# Altium project GD32F450_Main_Board_Camera_REV1.0.PrjPcb
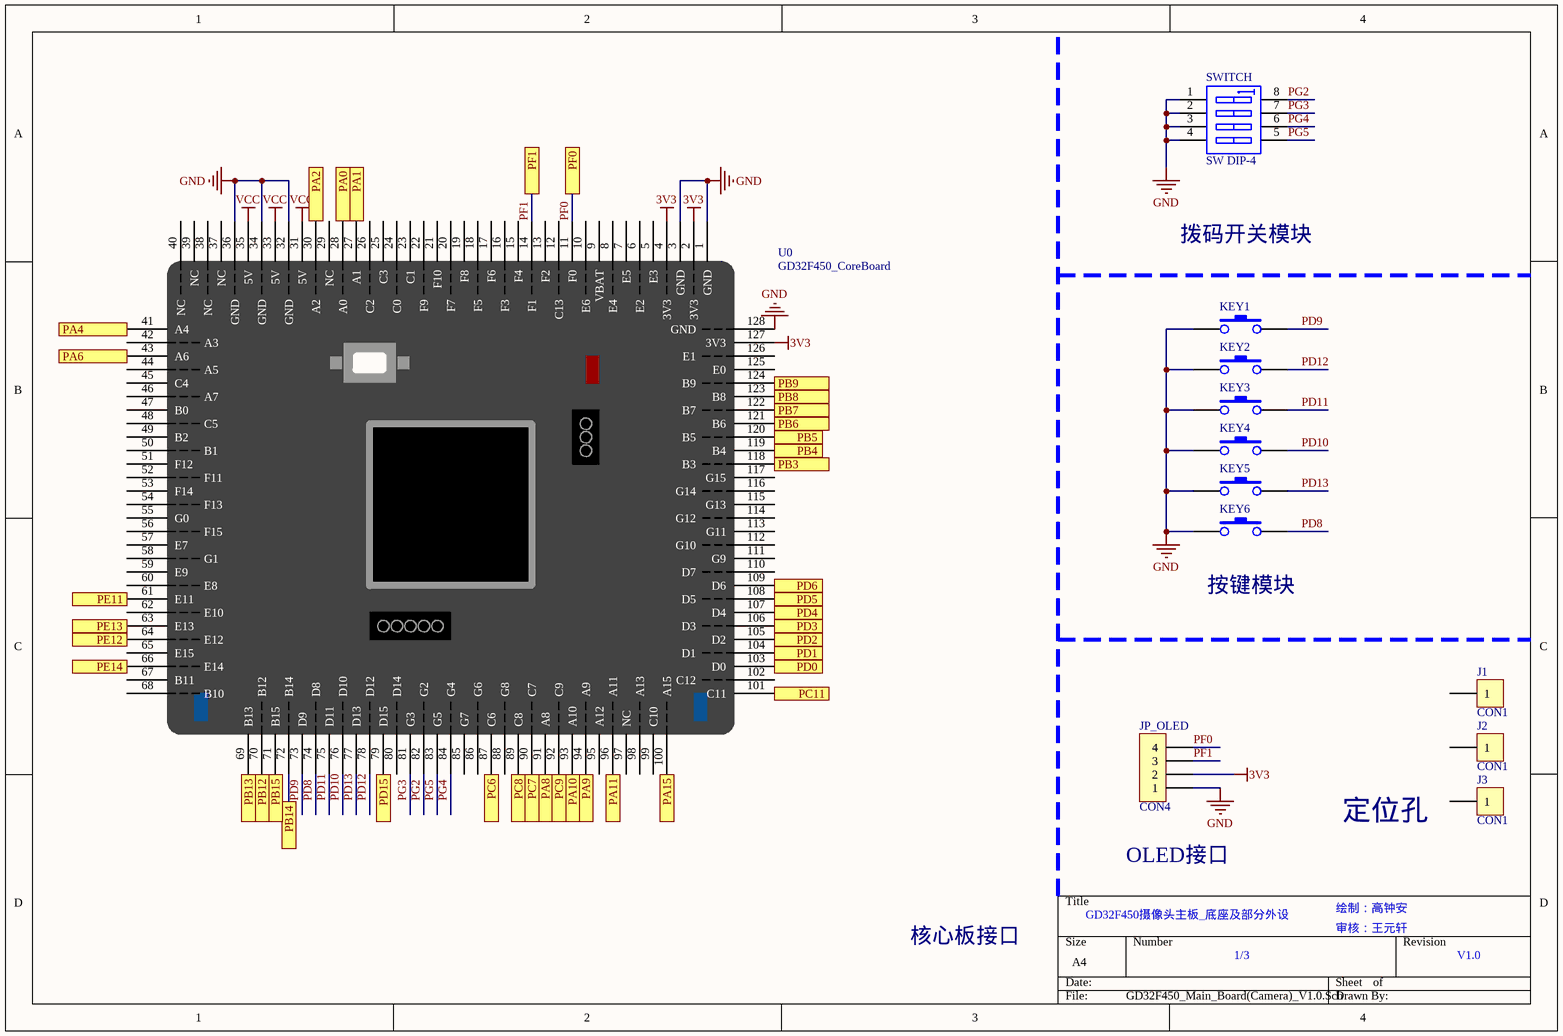
[diagram p0: GD32F450_Main_Board(Camera)_V1.0.SchDoc]
3 sheets, 73 parts. Net scope: flat (ports and power ports of the same name join across sheets).
Board files: Poly_GD32F450_Main_Board(Camera).PcbDoc, GD32F450_Main_Board(Camera).PcbDoc
Sheets:
  GD32F450_Main_Board(Camera)_V1.0.SchDoc
  GD32F450_Power_Manager(Camera)_V1.0.SchDoc
  GD32F450_External_Expansion(Camera)_V1.0.SchDoc

## Sheet GD32F450_Main_Board(Camera)_V1.0.SchDoc
size A4

### Parts
J1  CON1  [HOLE-3.5]
J2  CON1  [HOLE-3.5]
J3  CON1  [HOLE-3.5]
JP_OLED  CON4  [OLED]
KEY1  SW-PB  [KEY2-6X3]  (value not drawn)
KEY2  SW-PB  [KEY2-6X3]  (value not drawn)
KEY3  SW-PB  [KEY2-6X3]  (value not drawn)
KEY4  SW-PB  [KEY2-6X3]  (value not drawn)
KEY5  SW-PB  [KEY2-6X3]  (value not drawn)
KEY6  SW-PB  [KEY2-6X3]  (value not drawn)
SWITCH  SW DIP-4  [CSW DIP-4P]
U0  GD32F450_CoreBoard  [GD32F450_CoreBoard]

### Ports
PA0, PA1, PA2, PA4, PA6, PA8, PA9, PA10, PA11, PA15, PB3, PB4, PB5, PB6, PB7, PB8, PB9, PB12, PB13, PB14, PB15, PC6, PC7, PC8, PC9, PC11, PD0, PD1, PD2, PD3, PD4, PD5, PD6, PD15, PE11, PE12, PE13, PE14, PF0, PF1

### Nets
3V3: JP_OLED.2 U0.2(3V3) U0.4(3V3) U0.127(3V3)
GND: JP_OLED.1 KEY1.1 KEY2.1 KEY3.1 KEY4.1 KEY5.1 KEY6.1 SWITCH.1(A1) SWITCH.2(A2) SWITCH.3(A3) SWITCH.4(A4) U0.1(GND) U0.3(GND) U0.32(GND) U0.34(GND) U0.36(GND) U0.128(GND)
VCC: U0.31(5V) U0.33(5V) U0.35(5V)
PD8: KEY6.2 U0.74(D8)
PD9: KEY1.2 U0.73(D9)
PD10: KEY4.2 U0.76(D10)
PD11: KEY3.2 U0.75(D11)
PD12: KEY2.2 U0.78(D12)
PD13: KEY5.2 U0.77(D13)
PF0: JP_OLED.4 U0.11(F0) ; port PF0
PF1: JP_OLED.3 U0.14(F1) ; port PF1
PG2: SWITCH.8(B1) U0.82(G2)
PG3: SWITCH.7(B2) U0.81(G3)
PG4: SWITCH.6(B3) U0.84(G4)
PG5: SWITCH.5(B4) U0.83(G5)
NetJP_CameraZ_1: U0.87(C6) ; port PC6
NetJP_CameraZ_2: U0.43(A6) ; port PA6
NetJP_CameraZ_3: U0.90(C7) ; port PC7
NetJP_CameraZ_5: U0.89(C8) ; port PC8
NetJP_CameraZ_6: U0.118(B3) ; port PB3
NetJP_CameraZ_7: U0.92(C9) ; port PC9
NetJP_CameraZ_8: U0.100(A15) ; port PA15
NetJP_CameraZ_9: U0.101(C11) ; port PC11
NetJP_CameraZ_10: U0.41(A4) ; port PA4
NetJP_CameraZ_11: U0.121(B6) ; port PB6
NetJP_CameraZ_12: U0.122(B7) ; port PB7
NetJP_CameraZ_13: U0.123(B8) ; port PB8
NetJP_CameraZ_15: U0.124(B9) ; port PB9
NetJP_code1_3: U0.28(A0) ; port PA0
NetJP_code1_4: U0.27(A1) ; port PA1
NetJP_code2_3: U0.119(B4) ; port PB4
NetJP_code2_4: U0.120(B5) ; port PB5
NetJP_Moter_Drive_1: U0.91(A8) ; port PA8
NetJP_Moter_Drive_2: U0.94(A9) ; port PA9
NetJP_Moter_Drive_3: U0.93(A10) ; port PA10
NetJP_Moter_Drive_4: U0.96(A11) ; port PA11
NetJP_serial_port_5: U0.107(D4) ; port PD4
NetJP_serial_port_6: U0.109(D6) ; port PD6
NetJP_serial_port_8: U0.108(D5) ; port PD5
NetJP_Stear_1: U0.30(A2) ; port PA2
NetJP_TFT_3: U0.70(B12) ; port PB12
NetJP_TFT_4: U0.69(B13) ; port PB13
NetJP_TFT_5: U0.71(B15) ; port PB15
NetJP_TFT_6: U0.72(B14) ; port PB14
NetJP_TFT_7: U0.79(D15) ; port PD15
NetR11_2: U0.103(D0) ; port PD0
NetR12_2: U0.104(D1) ; port PD1
NetR13_2: U0.105(D2) ; port PD2
NetR14_2: U0.106(D3) ; port PD3
NetR51_1: U0.61(E11) ; port PE11
NetR52_1: U0.63(E13) ; port PE13
NetR53_1: U0.64(E12) ; port PE12
NetR54_1: U0.66(E14) ; port PE14

Not connected (* = marked no-connect by the designer): J1 1; J2 1; J3 1; U0 5(E3) 6(E2) 7(E5) 8(E4) 9(VBAT) 10(E6) 12(C13) 13(F2) 15(F4) 16(F3) 17(F6) 18(F5) 19(F8) 20(F7) 21(F10) 22(F9) 23(C1) 24(C0) 25(C3) 26(C2) 29(NC) 37(NC) 38(NC) 39(NC) 40(NC) 42(A3) 44(A5) 45(C4) 46(A7) 47(B0) 48(C5) 49(B2) 50(B1) 51(F12) 52(F11) 53(F14) 54(F13) 55(G0) 56(F15) 57(E7) 58(G1) 59(E9) 60(E8) 62(E10) 65(E15) 67(B11) 68(B10) 80(D14) 85(G7) 86(G6) 88(G8) 95(A12) 97(NC) 98(A13) 99(C10) 102(C12) 110(D7) 111(G9) 112(G10) 113(G11) 114(G12) 115(G13) 116(G14) 117(G15) 125(E0) 126(E1)

### Notes on the sheet
- 拨码开关模块
- (near KEY6) 按键模块
- 定位孔
- GD32F450摄像头主板_底座及部分外设
- OLED接口
- 绘制：高钟安
- 核心板接口
- 1/3
- 审核：王元轩
- V1.0

### Library data of the parts
J1-J3 = CON1: Connector
JP_OLED = CON4: Connector
SWITCH = SW DIP-4: DIP Switch

## Sheet GD32F450_Power_Manager(Camera)_V1.0.SchDoc
size A4
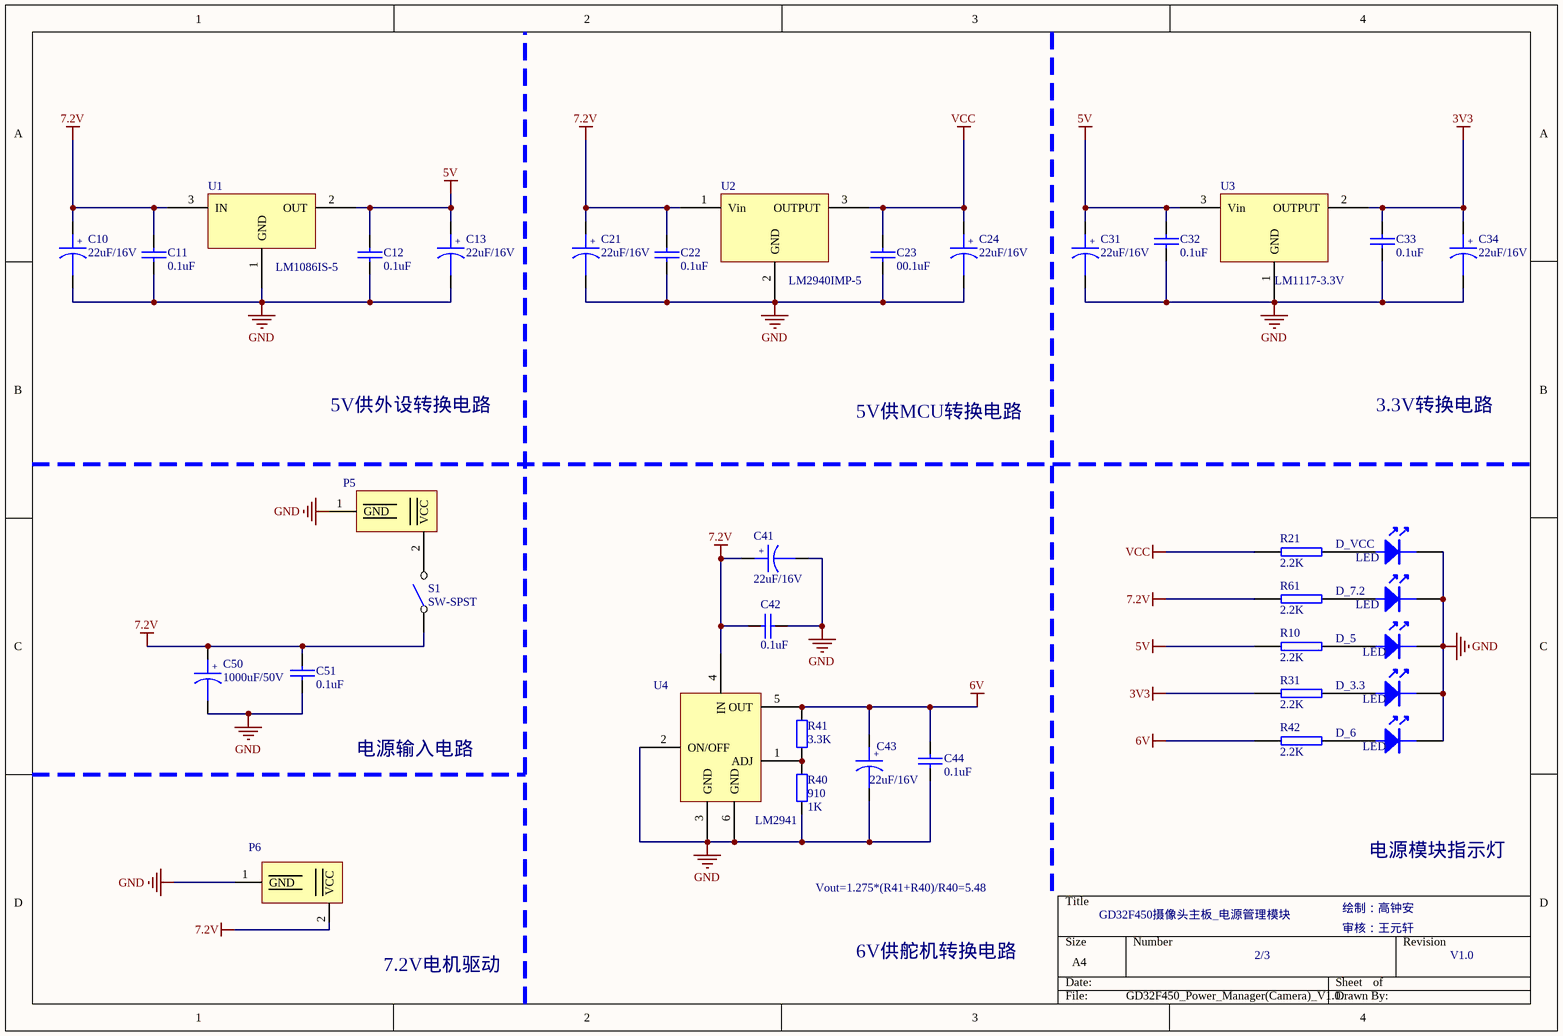
[diagram p1: GD32F450_Power_Manager(Camera)_V1.0.SchDoc]

### Parts
C10  22uF/16V  [3528]
C11  0.1uF  [0805C]
C12  0.1uF  [0805C]
C13  22uF/16V  [3528]
C21  22uF/16V  [3528]
C22  0.1uF  [0805C]
C23  00.1uF  [0805C]
C24  22uF/16V  [3528]
C31  22uF/16V  [3528]
C32  0.1uF  [0805C]
C33  0.1uF  [0805C]
C34  22uF/16V  [3528]
C41  22uF/16V  [3528]
C42  0.1uF  [0805C]
C43  22uF/16V  [3528]
C44  0.1uF  [0805C]
C50  1000uF/50V  [CM F(10*10.2)]
C51  0.1uF  [0805C]
D_3.3  LED  [1206LED]
D_5  LED  [1206LED]
D_6  LED  [1206LED]
D_7.2  LED  [1206LED]
D_VCC  LED  [1206LED]
P5  T_Type_Adapter  [T_Type_Adapter]  (value not drawn)
P6  T_Type_Adapter  [T_Type_Adapter]  (value not drawn)
R10  2.2K  [0805R]
R21  2.2K  [0805R]
R31  2.2K  [0805R]
R40  910  value 1K  [0805]
R41  3.3K  [0805]
R42  2.2K  [0805R]
R61  2.2K  [0805R]
S1  SW-SPST  [SWITCH-MINI]
U1  LM1086IS-5  [TO263-3A]
U2  LM2940IMP-5  [SOT-223]
U3  LM1117-3.3V  [SOT-223]
U4  LM2941  [TO-263]

### Nets
3V3: C33.1 C34.1 R31.1 U3.2(OUTPUT)
5V: C12.1 C13.1 C31.1 C32.1 R10.1 U1.2(OUT) U3.3(Vin)
6V: C43.1 C44.1 R41.2 R42.1 U4.5(OUT)
7.2V: C10.1 C11.1 C21.1 C22.1 C41.1 C42.1 C50.1 C51.1 P6.2(VCC) R61.1 S1.1 U1.3(IN) U2.1(Vin) U4.4(IN)
GND: C10.2 C11.2 C12.2 C13.2 C21.2 C22.2 C23.2 C24.2 C31.2 C32.2 C33.2 C34.2 C41.2 C42.2 C43.2 C44.2 C50.2 C51.2 D_3.3.K D_5.K D_6.K D_7.2.K D_VCC.K P5.1(GND) P6.1(GND) R40.1 U1.1(GND) U2.2(GND) U3.1(GND) U4.2(ON/OFF) U4.3(GND) U4.6(GND)
VCC: C23.1 C24.1 R21.1 U2.3(OUTPUT)
NetD_3.3_A: D_3.3.A R31.2
NetD_5_A: D_5.A R10.2
NetD_6_A: D_6.A R42.2
NetD_7.2_A: D_7.2.A R61.2
NetD_VCC_A: D_VCC.A R21.2
NetP5_2: P5.2(VCC) S1.2
NetR40_2: R40.2 R41.1 U4.1(ADJ)

### Notes on the sheet
- 5V供外设转换电路
- 5V供MCU转换电路
- 3.3V转换电路
- 电源输入电路
- Vout=1.275*(R41+R40)/R40=5.48
- GD32F450摄像头主板_电源管理模块
- 绘制：高钟安
- 电源模块指示灯
- 7.2V电机驱动
- 6V供舵机转换电路
- 2/3
- 审核：王元轩
- V1.0
- (in symbol CAPACITOR POL) +

### Library data of the parts
C10 C13 C21 C24 C31 C34 C41 C43 C50 = CAPACITOR POL: Capacitor
C11 C12 C22 C23 C32 C33 C42 C44 C51 = CAP: Capacitor
R10 R21 R31 R42 R61 = RES2
R40 R41 = Res2: Resistor; Published: 8-Jun-2000; LatestRevisionDate: 17-Jul-2002; LatestRevisionNote: Re-released for DXP Platform.; PackageReference: AXIAL-0.4; Publisher: Altium Limited; PackageDescription: Axial Device, Thru-Hole; 2 Leads; 0.4 in Pin Spacing
U1 = LT1086
U2 = LM1117-3.3V

## Sheet GD32F450_External_Expansion(Camera)_V1.0.SchDoc
size A4
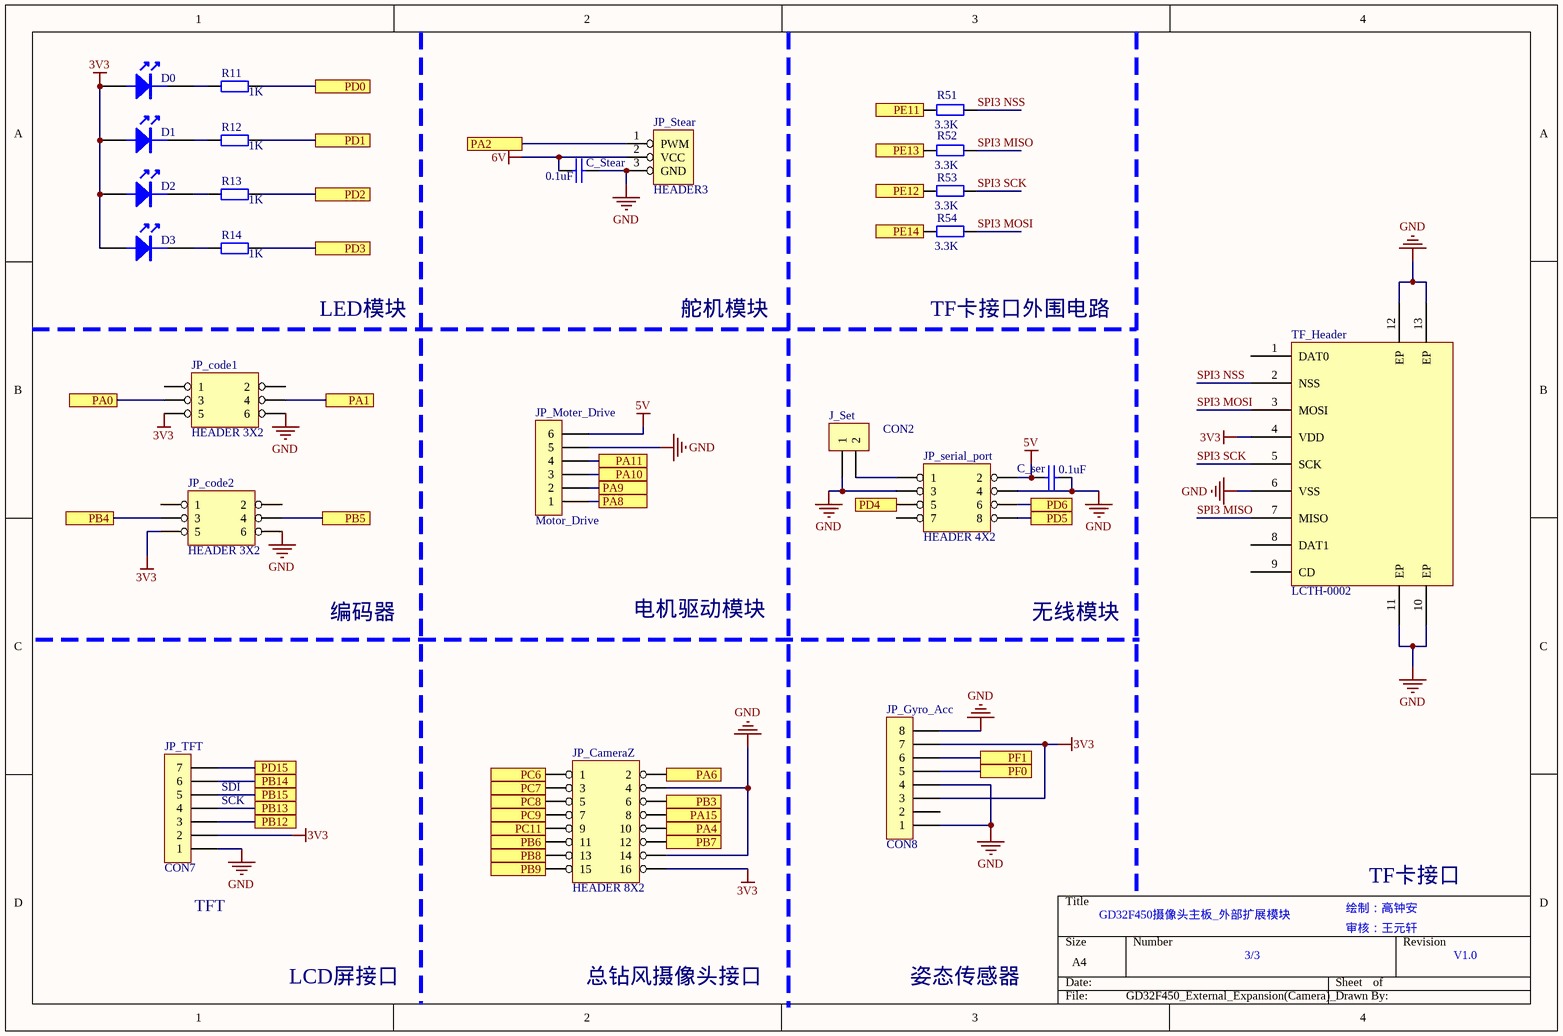
[diagram p2: GD32F450_External_Expansion(Camera)_V1.0.SchDoc]

### Parts
C_ser  0.1uF  [0805C]
C_Stear  0.1uF  [0805C]
D0  LED  [1206LED]  (value not drawn)
D1  LED  [1206LED]  (value not drawn)
D2  LED  [1206LED]  (value not drawn)
D3  LED  [1206LED]  (value not drawn)
J_Set  CON2  [SIP2]
JP_CameraZ  HEADER 8X2  [IDC16-JLC]
JP_code1  HEADER 3X2  [IDC6-JLC]
JP_code2  HEADER 3X2  [IDC6-JLC]
JP_Gyro_Acc  CON8  [SIP8]
JP_Moter_Drive  Motor_Drive  [SIP6N]
JP_serial_port  HEADER 4X2  [IDC8-JLC]
JP_Stear  HEADER3  [SIP3]
JP_TFT  CON7  [SIP7]
R11  value 1K  [0805R]  (hidden comment: Res2)
R12  value 1K  [0805R]  (hidden comment: Res2)
R13  value 1K  [0805R]  (hidden comment: Res2)
R14  value 1K  [0805R]  (hidden comment: Res2)
R51  value 3.3K  [0805R]
R52  value 3.3K  [0805R]
R53  value 3.3K  [0805R]
R54  value 3.3K  [0805R]
TF_Header  LCTH-0002  [TF_2]

### Ports
PA0, PA1, PA2, PA4, PA6, PA8, PA9, PA10, PA11, PA15, PB3, PB4, PB5, PB6, PB7, PB8, PB9, PB12, PB13, PB14, PB15, PC6, PC7, PC8, PC9, PC11, PD0, PD1, PD2, PD3, PD4, PD5, PD6, PD15, PE11, PE12, PE13, PE14, PF0, PF1

### Nets
3V3: D0.A D1.A D2.A D3.A JP_CameraZ.16 JP_code1.5 JP_code2.5 JP_Gyro_Acc.3 JP_Gyro_Acc.7 JP_TFT.2 TF_Header.4(VDD)
5V: C_ser.1 JP_Moter_Drive.6 JP_serial_port.2
6V: C_Stear.1 JP_Stear.2(VCC)
GND: C_ser.2 C_Stear.2 J_Set.1 JP_CameraZ.4 JP_CameraZ.14 JP_code1.6 JP_code2.6 JP_Gyro_Acc.1 JP_Gyro_Acc.4 JP_Gyro_Acc.8 JP_Moter_Drive.5 JP_serial_port.3 JP_serial_port.4 JP_Stear.3(GND) JP_TFT.1 TF_Header.6(VSS) TF_Header.10(EP) TF_Header.11(EP) TF_Header.12(EP) TF_Header.13(EP)
PF0: JP_Gyro_Acc.5 ; port PF0
PF1: JP_Gyro_Acc.6 ; port PF1
SPI3 MISO: R52.2 TF_Header.7(MISO)
SPI3 MOSI: R54.2 TF_Header.3(MOSI)
SPI3 NSS: R51.2 TF_Header.2(NSS)
SPI3 SCK: R53.2 TF_Header.5(SCK)
NetD0_K: D0.K R11.1
NetD1_K: D1.K R12.1
NetD2_K: D2.K R13.1
NetD3_K: D3.K R14.1
NetJ_Set_2: J_Set.2 JP_serial_port.1
NetJP_CameraZ_1: JP_CameraZ.1 ; port PC6
NetJP_CameraZ_2: JP_CameraZ.2 ; port PA6
NetJP_CameraZ_3: JP_CameraZ.3 ; port PC7
NetJP_CameraZ_5: JP_CameraZ.5 ; port PC8
NetJP_CameraZ_6: JP_CameraZ.6 ; port PB3
NetJP_CameraZ_7: JP_CameraZ.7 ; port PC9
NetJP_CameraZ_8: JP_CameraZ.8 ; port PA15
NetJP_CameraZ_9: JP_CameraZ.9 ; port PC11
NetJP_CameraZ_10: JP_CameraZ.10 ; port PA4
NetJP_CameraZ_11: JP_CameraZ.11 ; port PB6
NetJP_CameraZ_12: JP_CameraZ.12 ; port PB7
NetJP_CameraZ_13: JP_CameraZ.13 ; port PB8
NetJP_CameraZ_15: JP_CameraZ.15 ; port PB9
NetJP_code1_3: JP_code1.3 ; port PA0
NetJP_code1_4: JP_code1.4 ; port PA1
NetJP_code2_3: JP_code2.3 ; port PB4
NetJP_code2_4: JP_code2.4 ; port PB5
NetJP_Moter_Drive_1: JP_Moter_Drive.1 ; port PA8
NetJP_Moter_Drive_2: JP_Moter_Drive.2 ; port PA9
NetJP_Moter_Drive_3: JP_Moter_Drive.3 ; port PA10
NetJP_Moter_Drive_4: JP_Moter_Drive.4 ; port PA11
NetJP_serial_port_5: JP_serial_port.5 ; port PD4
NetJP_serial_port_6: JP_serial_port.6 ; port PD6
NetJP_serial_port_8: JP_serial_port.8 ; port PD5
NetJP_Stear_1: JP_Stear.1(PWM) ; port PA2
NetJP_TFT_3: JP_TFT.3 ; port PB12
NetJP_TFT_4: JP_TFT.4 ; port PB13
NetJP_TFT_5: JP_TFT.5 ; port PB15
NetJP_TFT_6: JP_TFT.6 ; port PB14
NetJP_TFT_7: JP_TFT.7 ; port PD15
NetR11_2: R11.2 ; port PD0
NetR12_2: R12.2 ; port PD1
NetR13_2: R13.2 ; port PD2
NetR14_2: R14.2 ; port PD3
NetR51_1: R51.1 ; port PE11
NetR52_1: R52.1 ; port PE13
NetR53_1: R53.1 ; port PE12
NetR54_1: R54.1 ; port PE14

Not connected (* = marked no-connect by the designer): JP_code1 1 2; JP_code2 1 2; JP_Gyro_Acc 2; JP_serial_port 7; TF_Header 1(DAT0) 8(DAT1) 9(CD)

### Notes on the sheet
- LED模块
- 舵机模块
- TF卡接口外围电路
- 编码器
- 电机驱动模块
- 无线模块
- (near JP_TFT) SDI
- (near JP_TFT) SCK
- (near JP_TFT) TFT
- GD32F450摄像头主板_外部扩展模块
- 绘制：高钟安
- TF卡接口
- LCD屏接口
- 总钻风摄像头接口
- 姿态传感器
- 3/3
- 审核：王元轩
- V1.0

### Library data of the parts
C_ser C_Stear = CAP: Capacitor
J_Set = CON2: Connector
JP_Gyro_Acc = CON8: Connector
JP_Moter_Drive = CON6: Connector
JP_Stear = STEER
JP_TFT = CON7: Connector
R11-R14 R51-R54 = Res2: Resistor; Published: 8-Jun-2000; LatestRevisionDate: 17-Jul-2002; LatestRevisionNote: Re-released for DXP Platform.; PackageReference: AXIAL-0.4; Publisher: Altium Limited
  R51-R54: PackageDescription: Axial Device, Thru-Hole; 2 Leads; 0.4 in Pin Spacing
TF_Header = Component_2

## Nets that join several sheets
3V3: GD32F450_Main_Board(Camera)_V1.0 (JP_OLED.2 U0.2 U0.4 U0.127), GD32F450_Power_Manager(Camera)_V1.0 (C33.1 C34.1 R31.1 U3.2), GD32F450_External_Expansion(Camera)_V1.0 (11 pins)
5V: GD32F450_Power_Manager(Camera)_V1.0 (7 pins), GD32F450_External_Expansion(Camera)_V1.0 (C_ser.1 JP_Moter_Drive.6 JP_serial_port.2)
6V: GD32F450_Power_Manager(Camera)_V1.0 (5 pins), GD32F450_External_Expansion(Camera)_V1.0 (C_Stear.1 JP_Stear.2)
GND: GD32F450_Main_Board(Camera)_V1.0 (17 pins), GD32F450_Power_Manager(Camera)_V1.0 (32 pins), GD32F450_External_Expansion(Camera)_V1.0 (20 pins)
VCC: GD32F450_Main_Board(Camera)_V1.0 (U0.31 U0.33 U0.35), GD32F450_Power_Manager(Camera)_V1.0 (C23.1 C24.1 R21.1 U2.3)
NetJP_CameraZ_1: GD32F450_Main_Board(Camera)_V1.0 (U0.87), GD32F450_External_Expansion(Camera)_V1.0 (JP_CameraZ.1)
NetJP_CameraZ_2: GD32F450_Main_Board(Camera)_V1.0 (U0.43), GD32F450_External_Expansion(Camera)_V1.0 (JP_CameraZ.2)
NetJP_CameraZ_3: GD32F450_Main_Board(Camera)_V1.0 (U0.90), GD32F450_External_Expansion(Camera)_V1.0 (JP_CameraZ.3)
NetJP_CameraZ_5: GD32F450_Main_Board(Camera)_V1.0 (U0.89), GD32F450_External_Expansion(Camera)_V1.0 (JP_CameraZ.5)
NetJP_CameraZ_6: GD32F450_Main_Board(Camera)_V1.0 (U0.118), GD32F450_External_Expansion(Camera)_V1.0 (JP_CameraZ.6)
NetJP_CameraZ_7: GD32F450_Main_Board(Camera)_V1.0 (U0.92), GD32F450_External_Expansion(Camera)_V1.0 (JP_CameraZ.7)
NetJP_CameraZ_8: GD32F450_Main_Board(Camera)_V1.0 (U0.100), GD32F450_External_Expansion(Camera)_V1.0 (JP_CameraZ.8)
NetJP_CameraZ_9: GD32F450_Main_Board(Camera)_V1.0 (U0.101), GD32F450_External_Expansion(Camera)_V1.0 (JP_CameraZ.9)
NetJP_CameraZ_10: GD32F450_Main_Board(Camera)_V1.0 (U0.41), GD32F450_External_Expansion(Camera)_V1.0 (JP_CameraZ.10)
NetJP_CameraZ_11: GD32F450_Main_Board(Camera)_V1.0 (U0.121), GD32F450_External_Expansion(Camera)_V1.0 (JP_CameraZ.11)
NetJP_CameraZ_12: GD32F450_Main_Board(Camera)_V1.0 (U0.122), GD32F450_External_Expansion(Camera)_V1.0 (JP_CameraZ.12)
NetJP_CameraZ_13: GD32F450_Main_Board(Camera)_V1.0 (U0.123), GD32F450_External_Expansion(Camera)_V1.0 (JP_CameraZ.13)
NetJP_CameraZ_15: GD32F450_Main_Board(Camera)_V1.0 (U0.124), GD32F450_External_Expansion(Camera)_V1.0 (JP_CameraZ.15)
NetJP_code1_3: GD32F450_Main_Board(Camera)_V1.0 (U0.28), GD32F450_External_Expansion(Camera)_V1.0 (JP_code1.3)
NetJP_code1_4: GD32F450_Main_Board(Camera)_V1.0 (U0.27), GD32F450_External_Expansion(Camera)_V1.0 (JP_code1.4)
NetJP_code2_3: GD32F450_Main_Board(Camera)_V1.0 (U0.119), GD32F450_External_Expansion(Camera)_V1.0 (JP_code2.3)
NetJP_code2_4: GD32F450_Main_Board(Camera)_V1.0 (U0.120), GD32F450_External_Expansion(Camera)_V1.0 (JP_code2.4)
NetJP_Moter_Drive_1: GD32F450_Main_Board(Camera)_V1.0 (U0.91), GD32F450_External_Expansion(Camera)_V1.0 (JP_Moter_Drive.1)
NetJP_Moter_Drive_2: GD32F450_Main_Board(Camera)_V1.0 (U0.94), GD32F450_External_Expansion(Camera)_V1.0 (JP_Moter_Drive.2)
NetJP_Moter_Drive_3: GD32F450_Main_Board(Camera)_V1.0 (U0.93), GD32F450_External_Expansion(Camera)_V1.0 (JP_Moter_Drive.3)
NetJP_Moter_Drive_4: GD32F450_Main_Board(Camera)_V1.0 (U0.96), GD32F450_External_Expansion(Camera)_V1.0 (JP_Moter_Drive.4)
NetJP_serial_port_5: GD32F450_Main_Board(Camera)_V1.0 (U0.107), GD32F450_External_Expansion(Camera)_V1.0 (JP_serial_port.5)
NetJP_serial_port_6: GD32F450_Main_Board(Camera)_V1.0 (U0.109), GD32F450_External_Expansion(Camera)_V1.0 (JP_serial_port.6)
NetJP_serial_port_8: GD32F450_Main_Board(Camera)_V1.0 (U0.108), GD32F450_External_Expansion(Camera)_V1.0 (JP_serial_port.8)
NetJP_Stear_1: GD32F450_Main_Board(Camera)_V1.0 (U0.30), GD32F450_External_Expansion(Camera)_V1.0 (JP_Stear.1)
NetJP_TFT_3: GD32F450_Main_Board(Camera)_V1.0 (U0.70), GD32F450_External_Expansion(Camera)_V1.0 (JP_TFT.3)
NetJP_TFT_4: GD32F450_Main_Board(Camera)_V1.0 (U0.69), GD32F450_External_Expansion(Camera)_V1.0 (JP_TFT.4)
NetJP_TFT_5: GD32F450_Main_Board(Camera)_V1.0 (U0.71), GD32F450_External_Expansion(Camera)_V1.0 (JP_TFT.5)
NetJP_TFT_6: GD32F450_Main_Board(Camera)_V1.0 (U0.72), GD32F450_External_Expansion(Camera)_V1.0 (JP_TFT.6)
NetJP_TFT_7: GD32F450_Main_Board(Camera)_V1.0 (U0.79), GD32F450_External_Expansion(Camera)_V1.0 (JP_TFT.7)
NetR11_2: GD32F450_Main_Board(Camera)_V1.0 (U0.103), GD32F450_External_Expansion(Camera)_V1.0 (R11.2)
NetR12_2: GD32F450_Main_Board(Camera)_V1.0 (U0.104), GD32F450_External_Expansion(Camera)_V1.0 (R12.2)
NetR13_2: GD32F450_Main_Board(Camera)_V1.0 (U0.105), GD32F450_External_Expansion(Camera)_V1.0 (R13.2)
NetR14_2: GD32F450_Main_Board(Camera)_V1.0 (U0.106), GD32F450_External_Expansion(Camera)_V1.0 (R14.2)
NetR51_1: GD32F450_Main_Board(Camera)_V1.0 (U0.61), GD32F450_External_Expansion(Camera)_V1.0 (R51.1)
NetR52_1: GD32F450_Main_Board(Camera)_V1.0 (U0.63), GD32F450_External_Expansion(Camera)_V1.0 (R52.1)
NetR53_1: GD32F450_Main_Board(Camera)_V1.0 (U0.64), GD32F450_External_Expansion(Camera)_V1.0 (R53.1)
NetR54_1: GD32F450_Main_Board(Camera)_V1.0 (U0.66), GD32F450_External_Expansion(Camera)_V1.0 (R54.1)
PF0: GD32F450_Main_Board(Camera)_V1.0 (JP_OLED.4 U0.11), GD32F450_External_Expansion(Camera)_V1.0 (JP_Gyro_Acc.5)
PF1: GD32F450_Main_Board(Camera)_V1.0 (JP_OLED.3 U0.14), GD32F450_External_Expansion(Camera)_V1.0 (JP_Gyro_Acc.6)